# Altium schematic sheet Main.SchDoc
size A; SheetNumber: 1; SheetTotal: 3
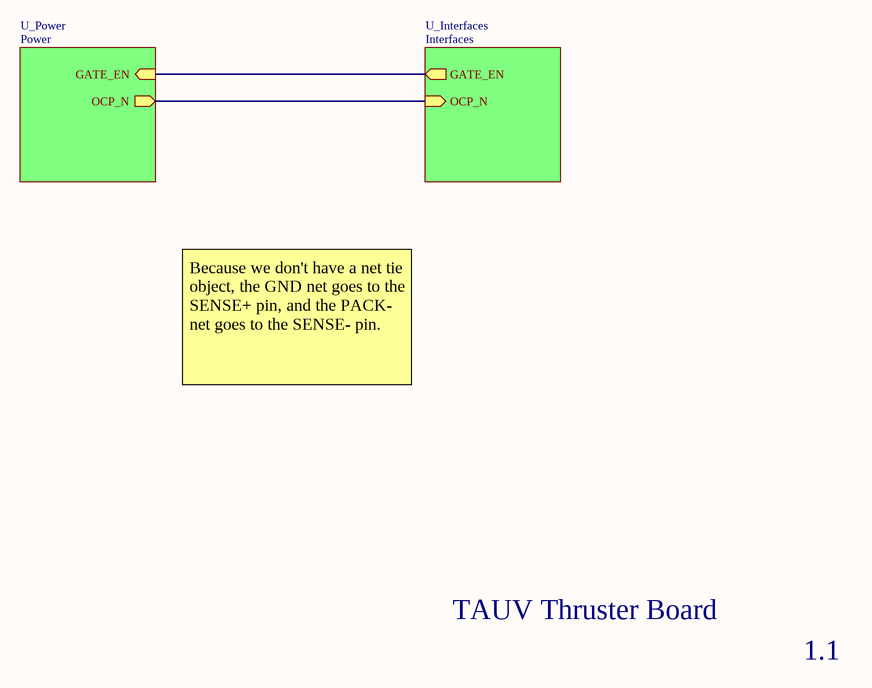
[diagram p0: Main.SchDoc]

## Sub-sheets
U_Interfaces = Interfaces: GATE_EN (out), OCP_N (in)
U_Power = Power: GATE_EN (in), OCP_N (out)

## Nets
(unnamed): sheet U_Power/GATE_EN, sheet U_Interfaces/GATE_EN
(unnamed): sheet U_Power/OCP_N, sheet U_Interfaces/OCP_N

## Notes on the sheet
- Because we don't have a net tie object, the GND net goes to the SENSE+ pin, and the PACK- net goes to the SENSE- pin.
- TAUV Thruster Board
- 1.1